# EasyEDA schematic SCH_Bullseye ESP32_2022-06-18.json
TITLE: Sheet_1; REV: 1.0; Date: 2022-01-28; Sheet: 1/1; Drawn By: smdial; Company: Your Company
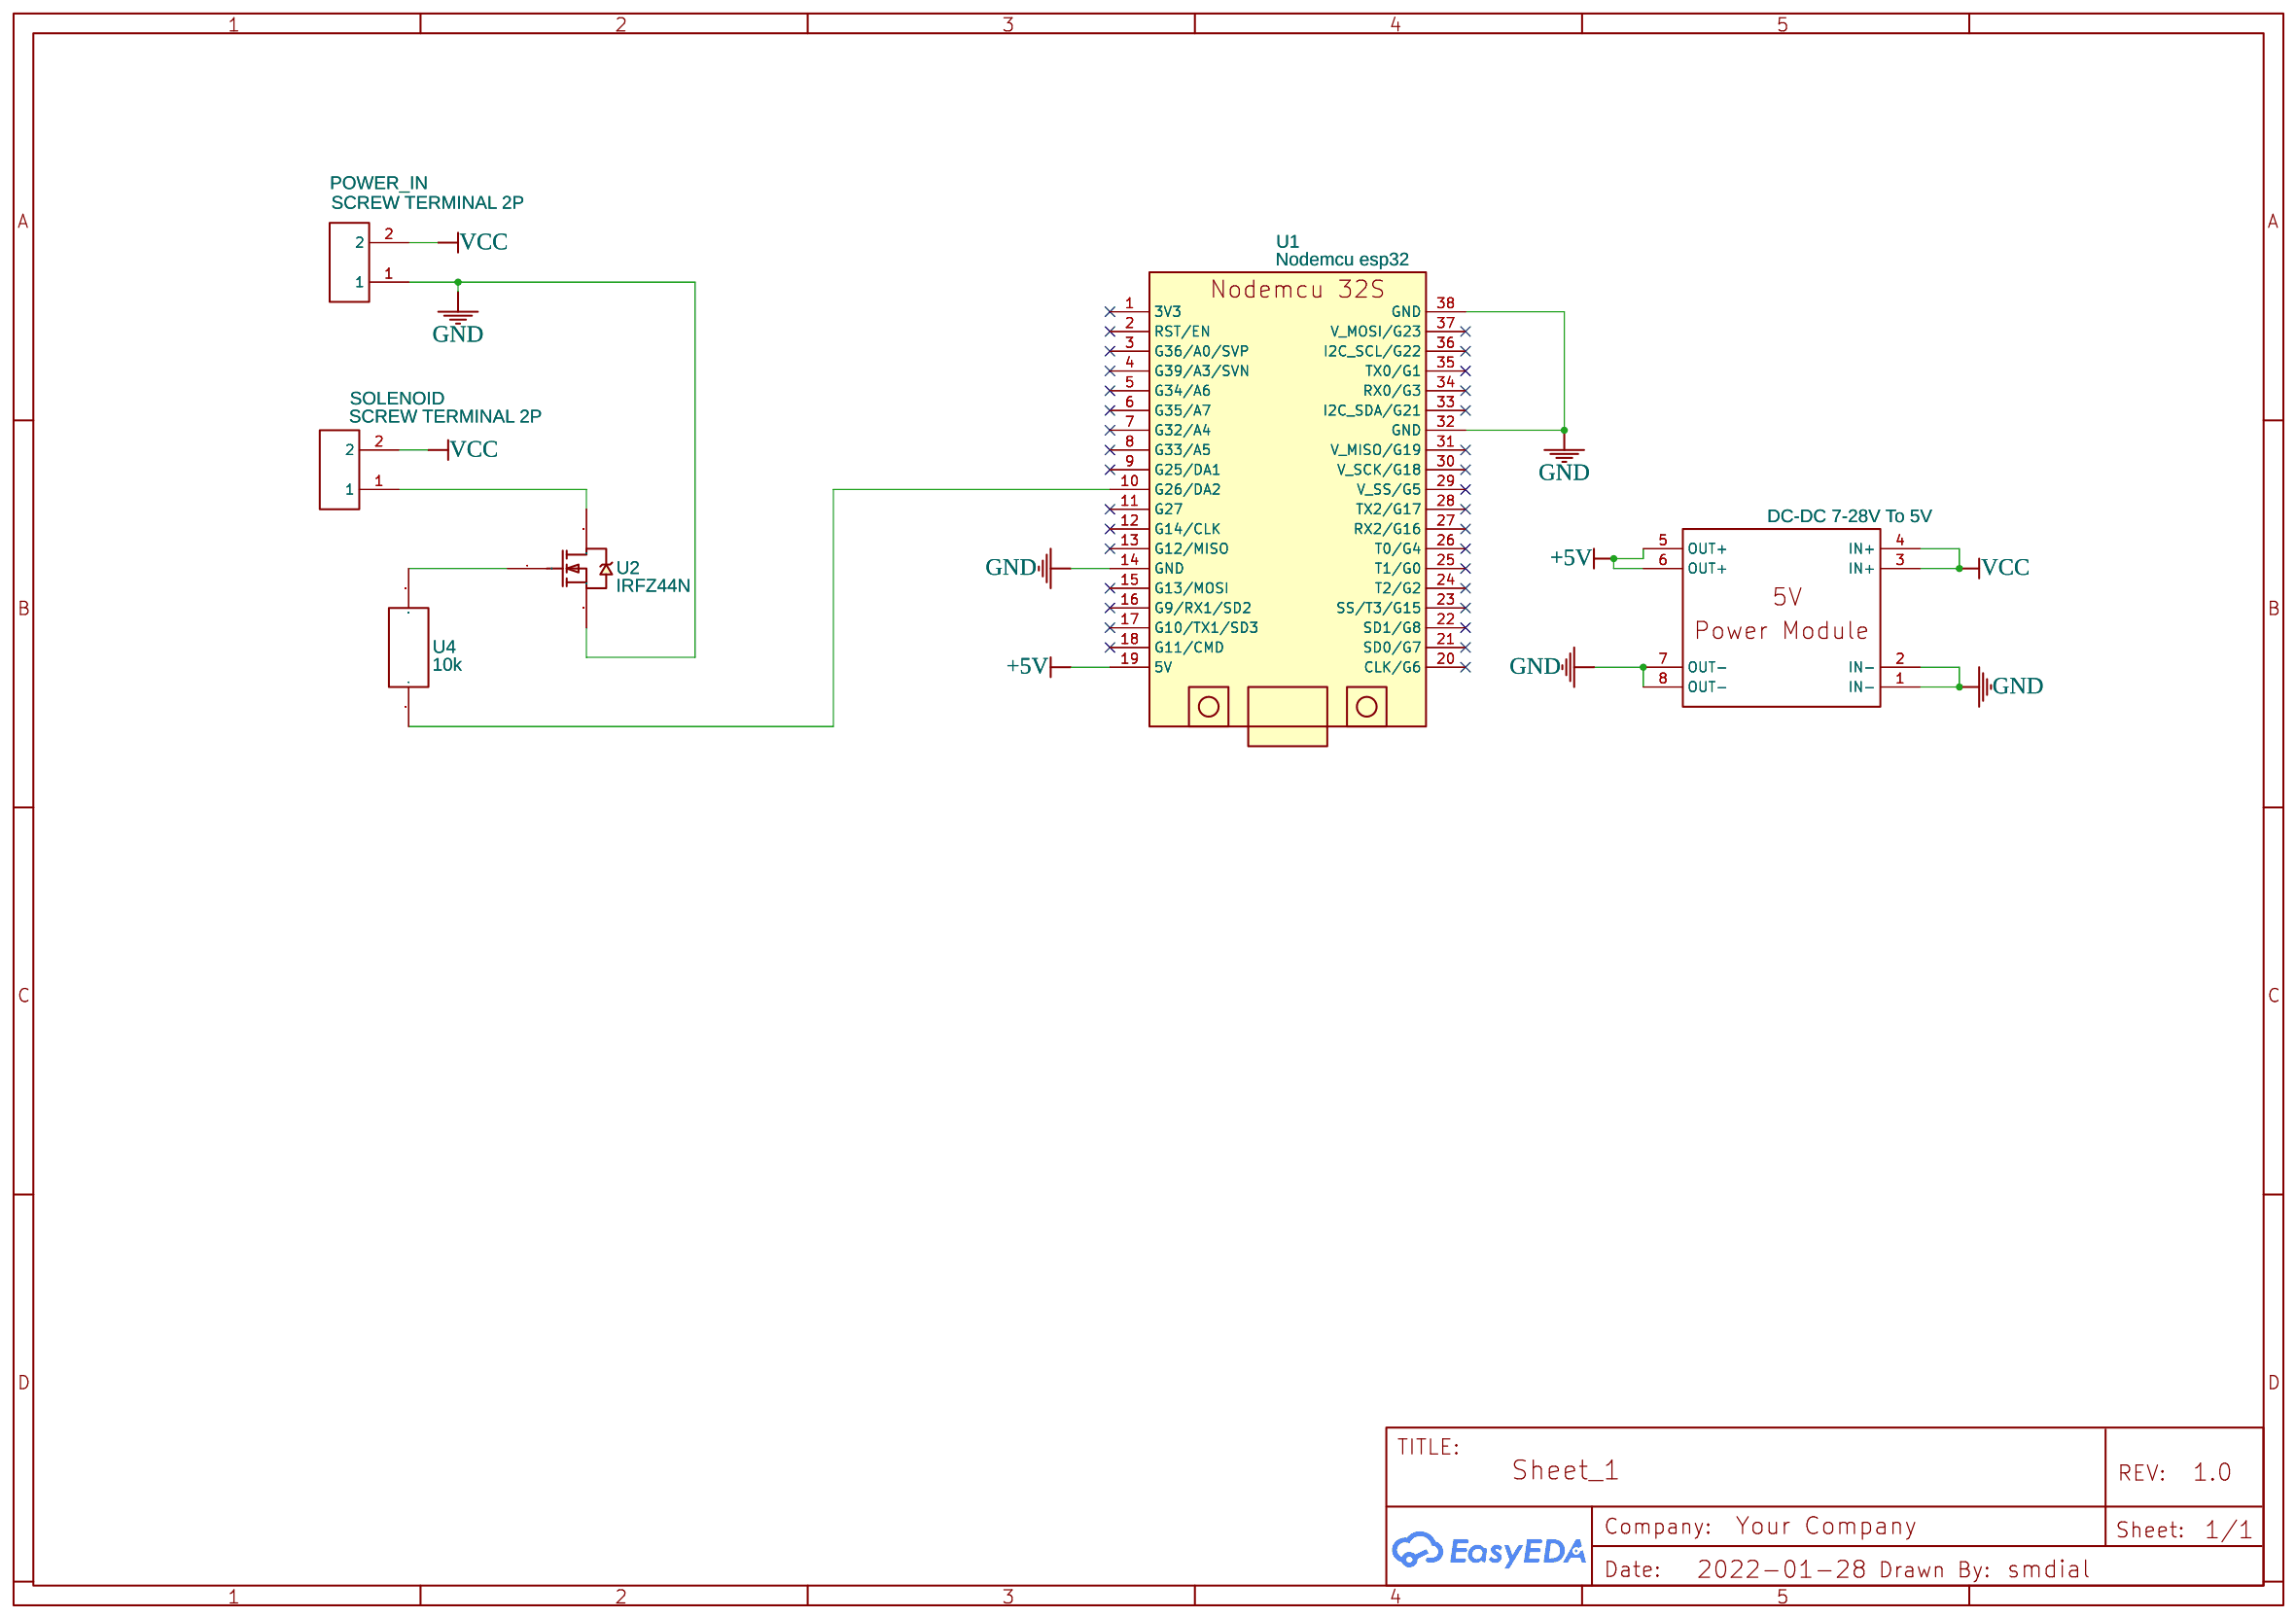
[diagram p0: schematic sheet]

## Parts
POWER_IN  SCREW TERMINAL 2P  [5.08-2P_SCREW_TERMINAL]
SOLENOID  SCREW TERMINAL 2P  [5.08-2P_SCREW_TERMINAL]
U1  Nodemcu esp32  [NODEMCU-ESP32S]
U2  IRFZ44N  [IRFZ44N]
U3  DC-DC 7-28V To 5V  [DM02]
U4  10k  [RESISTOR]

## Library data of the parts
POWER_IN SOLENOID = SCREW TERMINAL 2P: Manufacturer Part: Screw terminal 2p; Contributor: georges_circuits
U1 = Nodemcu esp32: Contributor: reinl.andreas
U2 = IRFZ44N: Manufacturer: International Rectifier; link: https://www.vishay.com/docs/91291/91291.pdf; Contributor: mehmetbey
U3 = DC-DC 7-28V To 5V Step Down Power Supply Module: link: DM02 POWER MODULE; Contributor: wichienkob
U4 = RESISTOR: Contributor: 12348

## Nets
+5V: U1.19(5V) U3.5(OUT+) U3.6(OUT+)
GND: POWER_IN.1 U1.14(GND) U1.32(GND) U1.38(GND) U2.3(S) U3.1(IN-) U3.2(IN-) U3.7(OUT-) U3.8(OUT-)
VCC: POWER_IN.2 SOLENOID.2 U3.3(IN+) U3.4(IN+)
Net-(SOLENOID-1): SOLENOID.1 U2.2(D)
Net-(U1-10): U1.10(G26/DA2) U4.1
Net-(U2-1): U2.1(G) U4.2

Not connected (* = marked no-connect by the designer): U1 1(3V3)* 2(RST/EN)* 3(G36/A0/SVP)* 4(G39/A3/SVN)* 5(G34/A6)* 6(G35/A7)* 7(G32/A4)* 8(G33/A5)* 9(G25/DA1)* 11(G27)* 12(G14/CLK)* 13(G12/MISO)* 15(G13/MOSI)* 16(G9/RX1/SD2)* 17(G10/TX1/SD3)* 18(G11/CMD)* 20(CLK/G6)* 21(SD0/G7)* 22(SD1/G8)* 23(SS/T3/G15)* 24(T2/G2)* 25(T1/G0)* 26(T0/G4)* 27(RX2/G16)* 28(TX2/G17)* 29(V_SS/G5)* 30(V_SCK/G18)* 31(V_MISO/G19)* 33(I2C SDA/G21)* 34(RX0/G3)* 35(TX0/G1)* 36(I2C SCL/G22)* 37(V_MOSI/G23)*
